# Altium schematic sheet GT-TC029B-H020-L1N1_GT-TC029B-H020-L1N.schdoc
size 127 x 99 mm
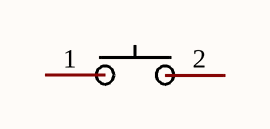
[diagram p0: GT-TC029B-H020-L1N1_GT-TC029B-H020-L1N.schdoc]

## Parts
SW?  GT-TC029B-H020-L1N  [SW-SMD_L3.9-W2.9-P4.15-LS5.0]  (value not drawn)

## Nets

Not connected (* = marked no-connect by the designer): SW? 1 2

## Library data of the parts
SW? = GT-TC029B-H020-L1N: Manufacturer: G-Switch(品赞); Add into BOM: yes; Circuit: 单刀单掷; Actuator Style: 圆形按钮; Operating Force: 2.5N; Switch Length: 3.9mm; Switch Width: 2.9mm; Switch Height: 2mm; Strike Gundam: 不带; Contact Current: 50mA; Voltage Rating (DC): 12V; Insulation Resistance: 100MΩ; Actuator/Cap Color: 黑色; With Lamp: 无; Pin Style: SMD接片; Mechanical Life: 10万次; Symbol: GT-TC029B-H020-L1N; Device: GT-TC029B-H020-L1N; LCSC Part Name: 3.9*2.9*2mm 立贴 轻触开关; Supplier Part: C843665; Manufacturer Part: GT-TC029B-H020-L1N; Supplier Footprint: SMD; JLCPCB Part Class: Extended Part; Datasheet: https://atta.szlcsc.com/upload/public/pdf/source/20231124/F8327E72251744D4A6AAF7192EF342CB.pdf; Supplier: LCSC; Convert to PCB: yes; Mounting Style: 立贴; Operating Temperature: -30℃~+85℃